# Altium schematic sheet 32MHz_clock.SchDoc
size A4; SheetNumber: 18; SheetTotal: 18
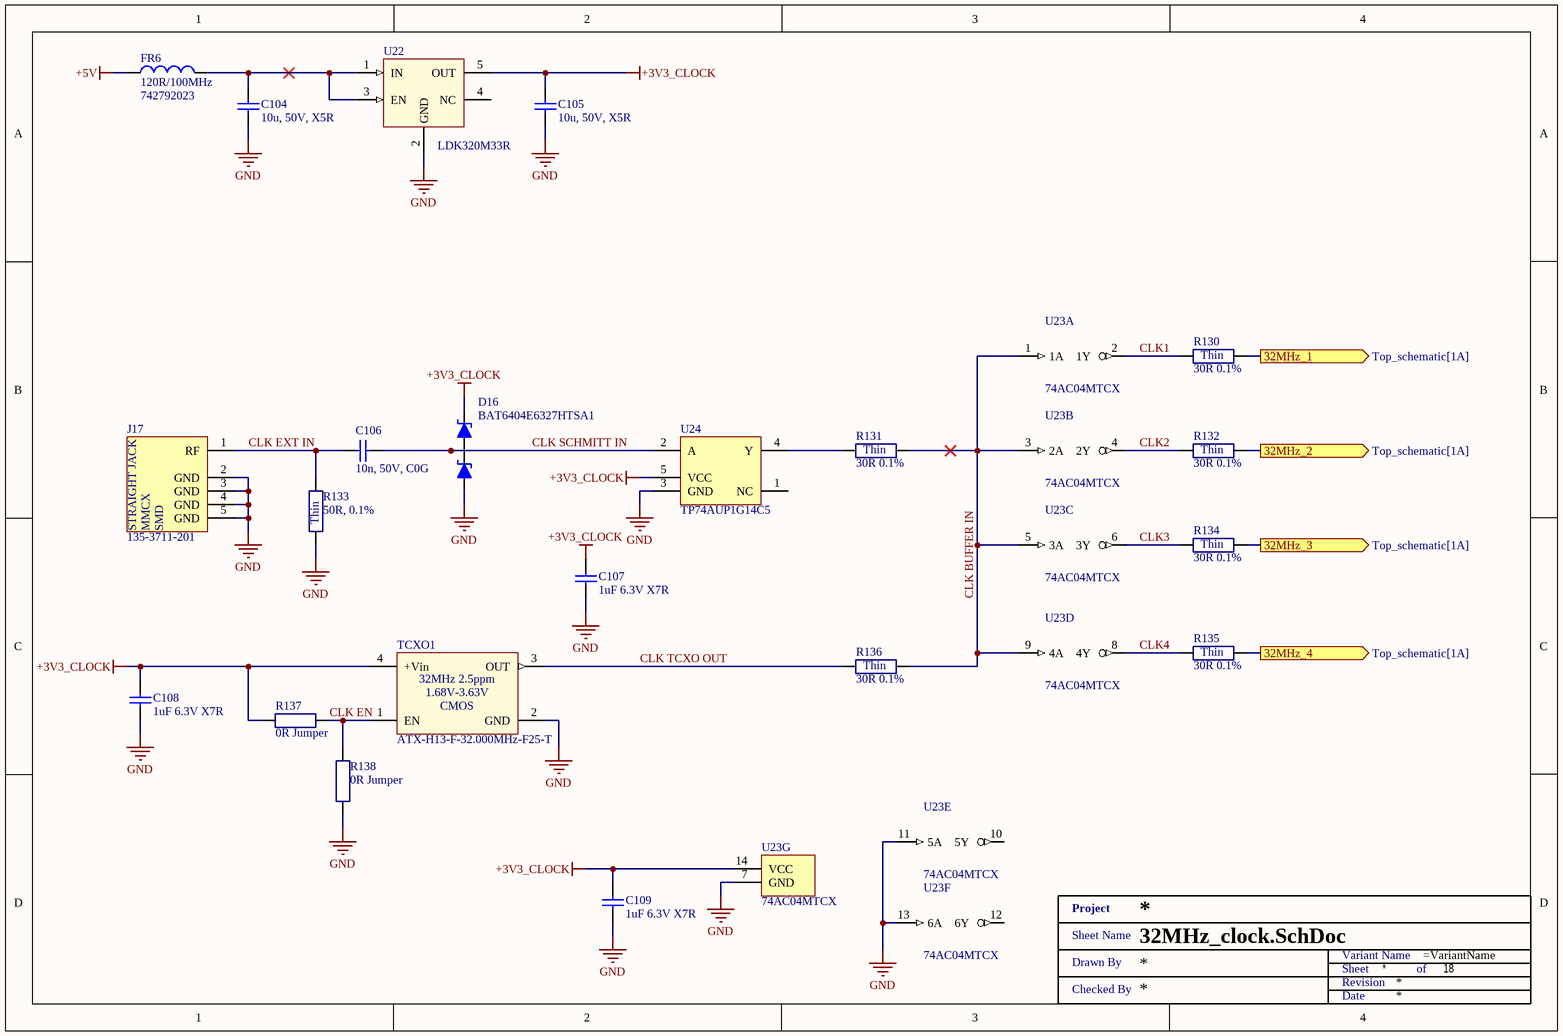
[diagram p0: 32MHz_clock.SchDoc]

## Parts
C104  10u, 50V, X5R  [SMD1206]
C105  10u, 50V, X5R  [SMD1206]
C106  10n, 50V, C0G  [SMD0603]
C107  1uF 6.3V X7R  [SMD0402]
C108  1uF 6.3V X7R  [SMD0402]
C109  1uF 6.3V X7R  [SMD0402]
D16  BAT6404E6327HTSA1  [SOT23 (TO-236AB)]
FR6  120R/100MHz  [SMD0805 - R]
J17  135-3711-201  [135-3711-201]
R130  30R 0.1%  [SMD0402 - R]
R131  30R 0.1%  [SMD0402 - R]
R132  30R 0.1%  [SMD0402 - R]
R133  50R, 0.1%  [SMD0603 - R]
R134  30R 0.1%  [SMD0402 - R]
R135  30R 0.1%  [SMD0402 - R]
R136  30R 0.1%  [SMD0402 - R]
R137  0R Jumper  [SMD0402 - R]
R138  0R Jumper  [SMD0402 - R]
TCXO1  ATX-H13-F-32.000MHz-F25-T  [2.0x1.6mm]
U22  LDK320M33R  [SOT23-5]
U23  74AC04MTCX  [TSSOP14]  (parts A,B,C,D,E,F,G of 7)
U24  TP74AUP1G14C5  [SOT353]
XX?  Title 1  (value not drawn)  (graphical)

## Ports
32MHz_1 (out, see Top_schematic[1A]), 32MHz_2 (out, see Top_schematic[1A]), 32MHz_3 (out, see Top_schematic[1A]), 32MHz_4 (out, see Top_schematic[1A])

## Nets
+3V3_CLOCK: C105.2 C107.2 C108.2 C109.2 D16.2(C) R137.1 TCXO1.4(+Vin) U22.5(OUT) U23.14(VCC) U24.5(VCC)
+5V: FR6.1
GND: C104.1 C105.1 C107.1 C108.1 C109.1 D16.1(A) J17.2(GND) J17.3(GND) J17.4(GND) J17.5(GND) R133.1 R138.1 TCXO1.2(GND) U22.2(GND) U23.7(GND) U23.11(5A) U23.13(6A) U24.3(GND)
32MHz_1: R130.2 ; port 32MHz_1
32MHz_2: R132.2 ; port 32MHz_2
32MHz_3: R134.2 ; port 32MHz_3
32MHz_4: R135.2 ; port 32MHz_4
CLK1: R130.1 U23.2(1Y)
CLK2: R132.1 U23.4(2Y)
CLK3: R134.1 U23.6(3Y)
CLK4: R135.1 U23.8(4Y)
CLK BUFFER IN: R131.2 R136.2 U23.1(1A) U23.3(2A) U23.5(3A) U23.9(4A)
CLK EN: R137.2 R138.2 TCXO1.1(EN)
CLK EXT IN: C106.2 J17.1(RF) R133.2
CLK SCHMITT IN: C106.1 D16.3(C) U24.2(A)
CLK TCXO OUT: R136.1 TCXO1.3(OUT)
NetC104_2: C104.2 FR6.2 U22.1(IN) U22.3(EN)
NetR131_1: R131.1 U24.4(Y)

Not connected (* = marked no-connect by the designer): U22 4(NC); U23 10(5Y) 12(6Y); U24 1(NC)

## Notes on the sheet
- (in symbol 135-3711-201) STRAIGHT JACK; MMCX; SMD
- (in symbol ATX-H13-F-32.000MHZ-F25-T) 32MHz 2.5ppm; 1.68V-3.63V
- (in symbol RT0603BRE0750RL) Thin
- (in symbol TC0225B300JTCC) Thin
- (in symbol Title 1) Project; Sheet Name; Variant Name; Drawn By; Sheet; of; Revision; Checked By; Date

## Library data of the parts
C104 C105 = UMK316BBJ106KL-T: CAP CER 10UF 50V X5R 1206; Manufacturer: Taiyo Yuden; Tolerance: 10%; Supplier 1: Mouser; Supplier Part Number 1: 963-UMK316BBJ106KL-T; Manufacturer Part Number: UMK316BBJ106KL-T; RoHS: Yes; Category: Ceramic Capacitors; Stock 1: 207945; Pricing 1: 1=0,42000, 10=0,18000, 100=0,12800, 500=0,11000, 1000=0,09700, 2000=0,08000 (USD); Mount: Surface Mount; Case/Package: 1206; Min Operating Temperature: -55°C; Max Operating Temperature: 85°C; Packaging: Tape and Reel; Capacitance: 10u; Voltage Rating: 50V; Length: 0.126inch; Width: 0.063inch; Thickness: 0.071inch; Lead Free: Lead Free; ComponentLink1URL: http://ds.yuden.co.jp/TYCOMPAS/ut/detail.do?productNo=UMK316BBJ106KL-T&fileName=UMK316BBJ106KL-T_SS&mode=specSheetDownload&src-supplier=Digi-Key; ComponentLink1Description: http://ds.yuden.co.jp/TYCOMPAS/ut/detail.do?productNo=UMK316BBJ106KL-T&fileName=UMK316BBJ106KL-T_SS&mode=specSheetDownload&src-supplier=Digi-Key; ComponentLink2URL: https://www.yuden.co.jp/productdata/catalog/mlcc01_e.pdf?src-supplier=Digi-Key; ComponentLink2Description: https://www.yuden.co.jp/productdata/catalog/mlcc01_e.pdf?src-supplier=Digi-Key; ComponentLink3URL: http://www.yuden.co.jp/productdata/catalog/en/mlcc_all_e.pdf?src-supplier=Digi-Key; ComponentLink3Description: http://www.yuden.co.jp/productdata/catalog/en/mlcc_all_e.pdf?src-supplier=Digi-Key; Supplier 2: Digi-Key; Supplier Part Number 2: 587-5960-1-ND; Supplier 3: Avnet; Supplier Part Number 3: UMK316BBJ106KL-T
C106 = GRM1885C1H103JA01D: Multilayer Ceramic Capacitors MLCC - SMD/SMT 0603 50VDC 10000pF 5% C0G; Manufacturer: Murata Electronics; Type: Chip Multilayer Ceramic Capacitor for General Purpose; Capacitance - nF: 10 nF; Class: Class 1; CNHTS: 8532241000; Dielectric: C0G (NP0); TARIC: 8532240000; Supplier 1: Mouser; Supplier Part Number 1: 81-GRM1885C1H103JA1D; Manufacturer Part Number: GRM1885C1H103JA01D; RoHS: RoHS Compliant; Category: Multilayer Ceramic Capacitors MLCC - SMD/SMT; Stock 1: 217291; Pricing 1: 1=0.183, 10=0.129, 100=0.065, 500=0.045, 1000=0.039, 4000=0.030, 8000=0.027, 24000=0.025 (EUR); Capacitance: 10n; Height: 0.8 mm; Length: 1.6 mm; Package / Case: 0603 (1608 metric); Packaging: Cut Tape; Product: General Type MLCCs; Series: GRM; Termination Style: SMD/SMT; Tolerance: 5 %; Voltage Rating DC: 50 VDC; Width: 0.8 mm; Brand: Murata Electronics; Capacitance - pF: 10000 pF; Case Code - in: 0603; Case Code - mm: 1608; HTS Code: 8532240020; Maximum Operating Temperature: + 125 C; Minimum Operating Temperature: - 55 C; Product Type: Ceramic Capacitors; Standard Pack Qty: 4000; Subcategory: Capacitors; Termination: Standard; RoHS - Mouser: Y; Minimum Order Quantity: 1; Reeling: True; ComponentLink1URL: http://www.mouser.com/datasheet/2/281/murata_03052018_GRM_Series_1-1310166.pdf; ComponentLink1Description: http://www.mouser.com/datasheet/2/281/murata_03052018_GRM_Series_1-1310166.pdf; Supplier 2: Farnell; Supplier Part Number 2: 2456107
C107-C109 = TCC0402X7R105K6R3AT: Capacitor: MLCC; SMD; 0402; 1µF; 6.3V; ±10%; X7R; CCTC; Capacitance: 1u; Supplier 1: LCSC; Supplier Part Number 1: C5448871; Manufacturer: CCTC; Manufacturer Part Number: TCC0402X7R105K6R3AT; Category: Ceramic Capacitors; Stock 1: 242350; Pricing 1: 50=0.0089, 500=0.0072, 1500=0.0063, 10000=0.0058, 20000=0.0053, 50000=0.005 (USD); ComponentLink1URL: https://datasheet.octopart.com:443/TCC0402X7R105K6R3AT-CCTC-datasheet-194166649.pdf?src-supplier=LCSC; ComponentLink1Description: https://datasheet.octopart.com:443/TCC0402X7R105K6R3AT-CCTC-datasheet-194166649.pdf?src-supplier=LCSC; ComponentLink2URL: https://datasheet.octopart.com:443/TCC0402X7R105K6R3AT-CCTC-datasheet-192317456.pdf?src-supplier=HQonline; ComponentLink2Description: https://datasheet.octopart.com:443/TCC0402X7R105K6R3AT-CCTC-datasheet-192317456.pdf?src-supplier=HQonline
D16 = BAT6404E6327HTSA1: Infineon 40V 250mA, Rectifier & Schottky Diode, SOT-23 BAT6404E6327HTSA1; Forward Voltage: 750mV; Peak Non-Repetitive Surge Current: 800mA; Reverse Recovery Time: 5ns; Average Rectified Current: 120mA; Value: 4pF; Element Configuration: Dual; Max Reverse Current: 2uA; Supplier 1: Mouser; Supplier Part Number 1: 726-BAT6404E6327HTSA; Manufacturer: Infineon; Manufacturer Part Number: BAT6404E6327HTSA1; RoHS: Yes; Category: Rectifier Diodes; Stock 1: 384914; Pricing 1: 1=0.15, 10=0.099, 50=0.099, 100=0.06, 1000=0.052, 10000=0.038 (USD); Mounting Technology: Surface Mount; Case/Package: SOT-23; Pins: 3; Min Operating Temperature: -55°C; Max Operating Temperature: 150°C; Packaging: Tape and Reel; Current Rating: 250mA; Voltage Rating (DC): 40V; Series: -; Max Reverse Voltage (DC): 40V; Max Forward Surge Current (Ifsm): 800mA; Package Quantity: 3000NUMBER; Reverse Voltage: 40V; Length: 2.9mm; Width: 1.3mm; Height: 1.1mm; Radiation Hardening: No; Lead Free: Lead Free; Halogen Free: Not Halogen Free; RoHS Compliant: Yes; Reach SVHC Compliant: 4186SVHC; ComponentLink1URL: https://datasheet.ciiva.com/3049/infineon-bat64series-ds-v01-01-en-3049368.pdf?src-supplier=Avnet; ComponentLink1Description: https://datasheet.ciiva.com/3049/infineon-bat64series-ds-v01-01-en-3049368.pdf?src-supplier=Avnet; ComponentLink2URL: https://datasheet.ciiva.com/6390/infineon-bat64series-ds-v01-01-en-6390184.pdf?src-supplier=Digikey; ComponentLink2Description: https://datasheet.ciiva.com/6390/infineon-bat64series-ds-v01-01-en-6390184.pdf?src-supplier=Digikey; ComponentLink3URL: https://datasheet.ciiva.com/6390/infineon-bat64series-ds-v01-01-en-6390183.pdf?src-supplier=Digikey; ComponentLink3Description: https://datasheet.ciiva.com/6390/infineon-bat64series-ds-v01-01-en-6390183.pdf?src-supplier=Digikey; ComponentLink4URL: https://datasheet.ciiva.com/8302/infineon-bat64series-ds-v01-01-en-8302938.pdf?src-supplier=Avnet; ComponentLink4Description: https://datasheet.ciiva.com/8302/infineon-bat64series-ds-v01-01-en-8302938.pdf?src-supplier=Avnet; Supplier 2: Farnell; Supplier Part Number 2: 2432680; Supplier 3: LCSC; Supplier Part Number 3: C513276; Supplier 4: TME; Supplier Part Number 4: BAT6404E6327HTSA1
FR6 = 742792023: WURTH ELEKTRONIK - 742792023 - FERRITE BEAD, 0.03OHM, 3A, 0805; Impedance @ 100MHz: 120; Ferrite Case Style: 0805 [2012 Metric]; DC Current Rating: 3; DC Resistance Max: 0.03; Impedance Tolerance: ± 25%; Ferrite Mounting: SMD; Resistance: 0.03ohm<!--FANDB--><div class="features-and-benefits-container"><div class="features-and-benefits-description"><span class="features-benefits-value">The 742792023 is a SMD EMI Suppression Ferrite Bead with 0805 case and reliable Ni-Sn electrodes. It can be put directly on the printed circuit board. It offers excellent anti-EMI properties and low DC resistance. Placed very close next to the interference source even with smallest size 0402, maximal impedance at 1000; Manufacturer: WURTH ELEKTRONIK; RoHS: YES; Stock 1: 4283; Pricing 1: 1=0,123, 50=0,112, 100=0,103, 500=0,0937, 1000=0,0877, 2000=0,0846 (GBP); Product Range: -; Automotive Qualification Standard: -; Packaging: Cut Tape; ComponentLink1URL: http://www.farnell.com/datasheets/1695980.pdf; ComponentLink1Description: http://www.farnell.com/datasheets/1695980.pdf; ComponentLink2URL: http://www.farnell.com/cad/1670054.zip; ComponentLink2Description: http://www.farnell.com/cad/1670054.zip; Supplier 1: Mouser; Supplier Part Number 1: 710-742792023; Supplier 2: Farnell; Supplier Part Number 2: 1635732; Supplier 3: Digi-Key; Supplier Part Number 3: 732-1613-1-ND; Manufacturer Part Number: 742792023
J17 = 135-3711-201: MMCX -   50 Ohm Connectors; Manufacturer: JOHNSON - CINCH CONNECTIVITY; Supplier 1: Mouser; Supplier Part Number 1: 530-135-3711-201; Manufacturer Part Number: 135-3711-201; RoHS: No; Stock 1: 1530; Pricing 1: 1=4.04000, 10=3.40000, 50=3.40000, 100=3.23000, 1000=2.95000, 10000=2.18000 (USD); ComponentLink1URL: http://www.farnell.com/datasheets/2341587.pdf?src-supplier=Farnell; ComponentLink1Description: http://www.farnell.com/datasheets/2341587.pdf?src-supplier=Farnell; ComponentLink2URL: http://www.farnell.com/datasheets/2341587.pdf?src-supplier=Newark; ComponentLink2Description: http://www.farnell.com/datasheets/2341587.pdf?src-supplier=Newark; Supplier 2: Farnell; Supplier Part Number 2: 1417969; Supplier 3: Arrow Electronics; Supplier Part Number 3: 135-3711-201
R130-R132 R134-R136 = TC0225B300JTCC: Resistor: thin film; SMD; 0402; 30Ω; 62.5mW; ±0.1%; TC25; 25V; -55÷155°C; Manufacturer: Uniroyal; Supplier 1: LCSC; Supplier Part Number 1: C50670254; Manufacturer Part Number: TC0225B300JTCC; Category: Uncategorized; Stock 1: 4950; Pricing 1: 50=0.0203, 500=0.0161, 1500=0.0137, 10000=0.0123, 20000=0.0111, 50000=0.0104 (USD); ComponentLink1URL: https://datasheet.octopart.com:443/TC0225B300JTCC-Uniroyal-datasheet-194228366.pdf?src-supplier=LCSC; ComponentLink1Description: https://datasheet.octopart.com:443/TC0225B300JTCC-Uniroyal-datasheet-194228366.pdf?src-supplier=LCSC; Resistance: 30R
R133 = RT0603BRE0750RL: 100mW Thin Film Resistor ±50ppm/℃ ±0.1% 50Ω 0603 Chip Resistor - Surface Mount ROHS; Manufacturer: Yageo Group; Temperature Coefficient: 50ppm/°C; Working Voltage: 75V; Manufacturer Part Number: RT0603BRE0750RL; RoHS: Compliant; Category: Chip SMD Resistors; Stock 1: 3090; Pricing 1: 1=0.109, 25=0.092, 50=0.086, 100=0.08, 250=0.075, 500=0.071, 1000=0.068 (USD); Case/Package: 0603; China RoHS: Non-Compliant; Composition: Thin Film; Country of Origin: Mainland China, Taiwan; Export Control Classification Number (ECCN) Code: EAR99; Features: Moisture Resistant; Height: 558.8µm; Harmonized Tariff Schedule (HTS) Code: 8533.21.00.30; Introduction Date: 2017-09-12; Length: 1.6002mm; Lifecycle Status: Production; Max Operating Temperature: 155°C; Max Power Dissipation: 100mW; Min Operating Temperature: -55°C; Mounting Technology: Surface Mount; Number of Terminals: 2; Number of Terminations: 2; Packaging: Tape & Reel; Power Rating: 100mW; REACH SVHC: Yes; Resistance: 50R; Tolerance: 0.1%; Width: 787.4µm; ComponentLink1URL: https://datasheet.octopart.com:443/RT0603BRE0750RL-Yageo-datasheet-96443642.pdf?src-supplier=IHS; ComponentLink1Description: https://datasheet.octopart.com:443/RT0603BRE0750RL-Yageo-datasheet-96443642.pdf?src-supplier=IHS; ComponentLink2URL: https://datasheet.octopart.com:443/RT0603BRE0750RL-Yageo-datasheet-176402239.pdf?src-supplier=Future+Electronics; ComponentLink2Description: https://datasheet.octopart.com:443/RT0603BRE0750RL-Yageo-datasheet-176402239.pdf?src-supplier=Future+Electronics; ComponentLink3URL: https://datasheet.octopart.com:443/RT0603BRE0750RL-Yageo-datasheet-169971040.pdf?src-supplier=Future+Electronics; ComponentLink3Description: https://datasheet.octopart.com:443/RT0603BRE0750RL-Yageo-datasheet-169971040.pdf?src-supplier=Future+Electronics; ComponentLink4URL: https://datasheet.octopart.com:443/RT0603BRE0750RL-Yageo-datasheet-166250672.pdf?src-supplier=Future+Electronics; ComponentLink4Description: https://datasheet.octopart.com:443/RT0603BRE0750RL-Yageo-datasheet-166250672.pdf?src-supplier=Future+Electronics; ComponentLink5URL: https://datasheet.octopart.com:443/RT0603BRE0750RL-Yageo-datasheet-137700930.pdf?src-supplier=Future+Electronics; ComponentLink5Description: https://datasheet.octopart.com:443/RT0603BRE0750RL-Yageo-datasheet-137700930.pdf?src-supplier=Future+Electronics; ComponentLink6URL: https://datasheet.octopart.com:443/RT0603BRE0750RL-Yageo-Group-datasheet-141265893.pdf?src-supplier=ODG+(Origin+Data+Global); ComponentLink6Description: https://datasheet.octopart.com:443/RT0603BRE0750RL-Yageo-Group-datasheet-141265893.pdf?src-supplier=ODG+(Origin+Data+Global); ComponentLink7URL: https://datasheet.octopart.com/RT0603BRE0750RL-Yageo-datasheet-86813807.pdf; ComponentLink7Description: https://datasheet.octopart.com/RT0603BRE0750RL-Yageo-datasheet-86813807.pdf; ComponentLink8URL: http://sigma.octopart.com:80/conflict_mineral_statement/Yageo-company-3.pdf?src-supplier=Compliance+Statements; ComponentLink8Description: http://sigma.octopart.com:80/conflict_mineral_statement/Yageo-company-3.pdf?src-supplier=Compliance+Statements; ComponentLink9URL: http://sigma.octopart.com:80/rohs_statement/Yageo-company-2.pdf?src-supplier=Compliance+Statements; ComponentLink9Description: http://sigma.octopart.com:80/rohs_statement/Yageo-company-2.pdf?src-supplier=Compliance+Statements; Supplier 1: Mouser; Supplier Part Number 1: 603-RT0603BRE0750RL; Supplier 2: LCSC; Supplier Part Number 2: C849792; Supplier 3: Farnell; Supplier Part Number 3: RT0603BRE0750RL; Supplier 4: Newark; Supplier Part Number 4: RT0603BRE0750RL
R137 R138 = HQ02WAF0000TCE: Resistor: thick film / jumper; SMD; 0402; 0Ω; 100mW; max 50V; -55÷155°C; UNI-ROYAL; Manufacturer: Uniroyal; Supplier 1: LCSC; Supplier Part Number 1: C2791314; Manufacturer Part Number: HQ02WAF0000TCE; Category: Uncategorized; Stock 1: 5900; Pricing 1: 100=0.0059, 1000=0.0051, 3000=0.0047, 10000=0.0045, 50000=0.0043 (USD); ComponentLink1URL: https://datasheet.octopart.com:443/HQ02WAF0000TCE-Uniroyal-datasheet-194224146.pdf?src-supplier=LCSC; ComponentLink1Description: https://datasheet.octopart.com:443/HQ02WAF0000TCE-Uniroyal-datasheet-194224146.pdf?src-supplier=LCSC; Resistance: 0R
TCXO1 = ATX-H13-F-32.000MHZ-F25-T: Oscillator TCXO 32MHz ±2ppm (Tol) ±2.5ppm (Stability) 15pF CMOS 55% 1.8V/2.5V/2.8V/3V/3.3V T/R; Manufacturer: Abracon; Operating Supply Voltage: 1.8V; Supplier: Mouser; Supplier Part Number: 815-H13F32000MHZF25T; Manufacturer Part Number: ATX-H13-F-32.000MHZ-F25-T; RoHS: Compliant; Category: Controlled Oscillators; Stock: 2722; Pricing: 1=2,16, 10=1,87, 50=1,71, 100=1,62, 1000=1,36, 10000=1,28 (USD); Frequency: 32MHz; Frequency Stability: 2ppm; Introduction Date: 2023-05-26; Lifecycle Status: Production; Pins: 4; Output Type: CMOS; REACH SVHC: Yes; ComponentLink1URL: https://datasheet.octopart.com:443/ATX-H13-F-32.000MHZ-F25-T-Abracon-datasheet-182217459.pdf?src-supplier=IHS; ComponentLink1Description: https://datasheet.octopart.com:443/ATX-H13-F-32.000MHZ-F25-T-Abracon-datasheet-182217459.pdf?src-supplier=IHS; ComponentLink2URL: http://sigma.octopart.com:80/conflict_mineral_statement/Abracon-company-27.pdf?src-supplier=Compliance+Statements; ComponentLink2Description: http://sigma.octopart.com:80/conflict_mineral_statement/Abracon-company-27.pdf?src-supplier=Compliance+Statements; Supplier 1: Mouser; Supplier Part Number 1: 815-H13F32000MHZF25T; Supplier 2: Farnell; Supplier Part Number 2: ATX-H13-F-32.000MHZ-F25-T
U22 = LDK320M33R: IC REG LINEAR 200MA SOT23-5; Manufacturer: STMicroelectronics; Output Configuration: Positive; Output Type: Fixed; Voltage - Input (Max): 18V; Voltage - Output (Min/Fixed): 3.3V; Voltage Dropout (Max): 0.35V @ 200mA; PSRR: 88dB (120Hz); Control Features: Enable; Protection Features: Over Current, Over Temperature; Manufacturer Part Number: LDK320M33R; RoHS: RoHS Compliant; Category: Integrated Circuits (ICs); Stock 1: 5592; Pricing 1: 1=0.85, 10=0.748, 100=0.5733, 500=0.4532, 1000=0.36256 (USD); Packaging: Cut Tape (CT); Part Status: Active; Current - Output: 200mA; Operating Temperature: -40°C ~ 125°C (TJ); Mounting Type: Surface Mount; Package / Case: SC-74A, SOT-753; Supplier Device Package: SOT-23-5; ComponentLink1URL: http://www.st.com/content/ccc/resource/technical/document/datasheet/0e/0c/26/c9/a4/d4/4b/a1/DM00236470.pdf/files/DM00236470.pdf/jcr:content/translations/en.DM00236470.pdf; ComponentLink1Description: http://www.st.com/content/ccc/resource/technical/document/datasheet/0e/0c/26/c9/a4/d4/4b/a1/DM00236470.pdf/files/DM00236470.pdf/jcr:content/translations/en.DM00236470.pdf; Supplier 1: Mouser; Supplier Part Number 1: 511-LDK320M33R; Supplier 2: Farnell; Supplier Part Number 2: 3130011; Supplier 3: Digi-Key; Supplier Part Number 3: 497-17034-1-ND
U23 = 74AC04MTCX: IC INVERTER 6CH 6-INP 14TSSOP; Manufacturer: ON Semiconductor; Logic Function: NOT; Number of Inputs: 6; Voltage - Supply: 2 V ~ 6 V; Current - Output High, Low: 24mA, 24mA; Logic Level - Low: 0.9 V ~ 1.65 V; Logic Level - High: 2.1 V ~ 3.85 V; Max Propagation Delay @ V, Max CL: 7ns @ 5V, 50pF; Supplier 1: Digi-Key; Supplier Part Number 1: 74AC04MTCXCT-ND; Manufacturer Part Number: 74AC04MTCX; RoHS: RoHS Compliant; Category: Integrated Circuits (ICs); Stock 1: 2436; Pricing 1: 1=0.42, 10=0.362, 100=0.2705, 500=0.21254, 1000=0.16424 (USD); Packaging: Cut Tape (CT); Part Status: Active; Features: -; Operating Temperature: -40°C ~ 85°C; Mounting Type: Surface Mount; Supplier Device Package: 14-TSSOP; Package / Case: 14-TSSOP (0.173", 4.40mm Width); Base Part Number: 74AC04; ComponentLink1URL: https://www.fairchildsemi.com/datasheets/74/74AC04.pdf; ComponentLink1Description: https://www.fairchildsemi.com/datasheets/74/74AC04.pdf; Supplier 2: Farnell; Supplier Part Number 2: 2724116; Supplier 3: Mouser; Supplier Part Number 3: 512-74AC04MTCX
U24 = TP74AUP1G14C5: Schmitt trigger 800mV~3.6V 3ns@3.3V,5pF 1 500nA SOT-353 Gates and Inverters RoHS; Manufacturer: Tech Public; Supplier: LCSC; Supplier Part Number: C51939619; Manufacturer Part Number: TP74AUP1G14C5; Category: Logic Gates; Stock: 2680; Pricing: 10=0,0496, 100=0,0391, 300=0,0338, 3000=0,0298, 6000=0,0266, 9000=0,025 (USD)